# EAGLE design Zio Qwiic HAT (EAGLE 9.1.1)
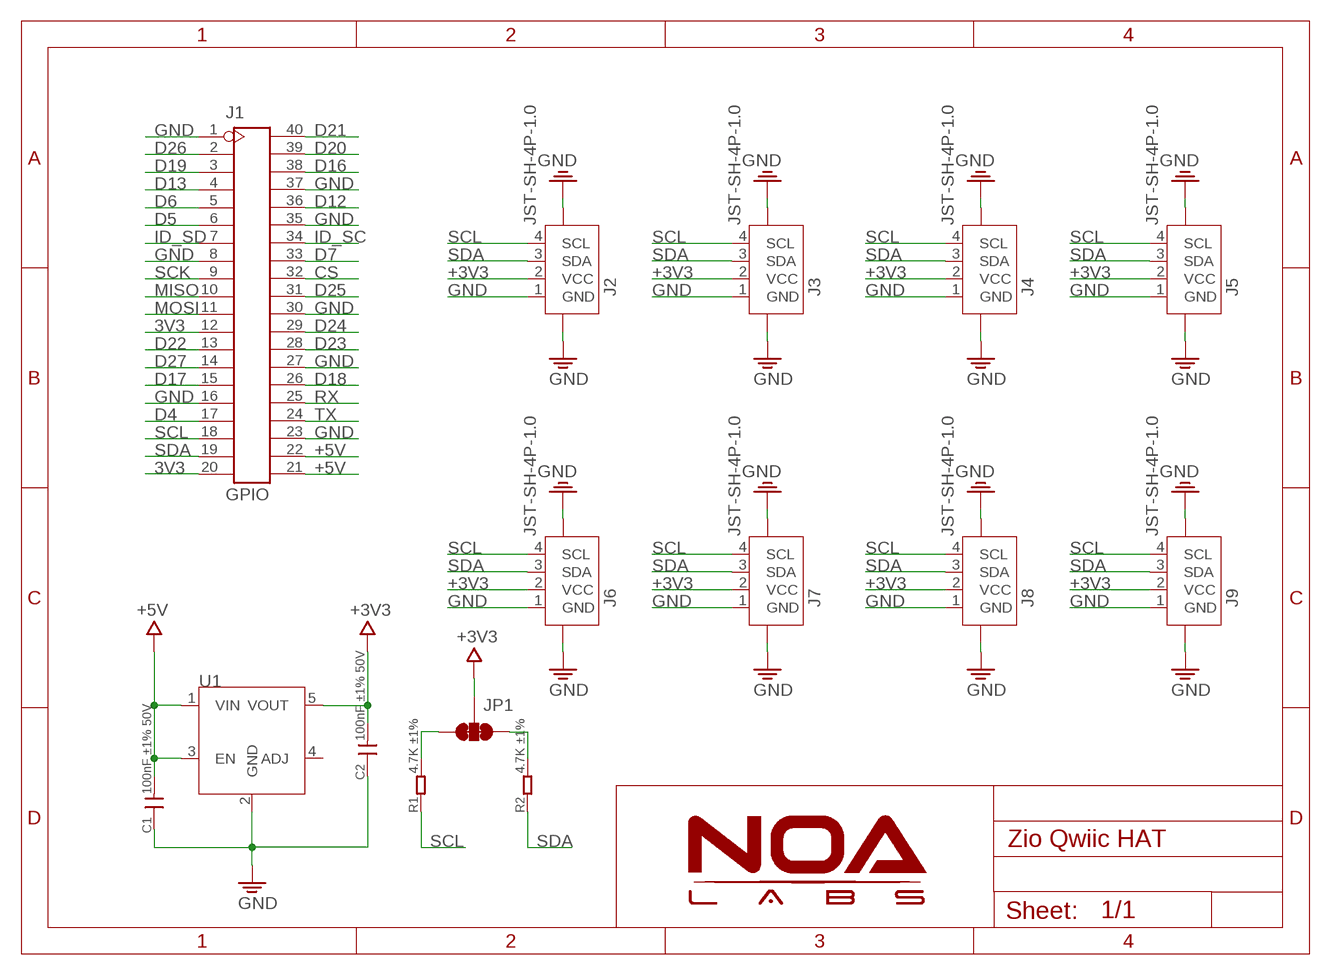
[diagram p0: schematic, sheet 1]

## Parts
C1  100nF ±1% 50V  C-0603  [C0603]
C2  100nF ±1% 50V  C-0603  [C0603]
J1  GPIO  HEADER_2X20P  [2X20P_2.54]
J2  JST-SH-4P-1.0  [JST-SH-4P]
J3  JST-SH-4P-1.0  [JST-SH-4P]
J4  JST-SH-4P-1.0  [JST-SH-4P]
J5  JST-SH-4P-1.0  [JST-SH-4P]
J6  JST-SH-4P-1.0  [JST-SH-4P]
J7  JST-SH-4P-1.0  [JST-SH-4P]
J8  JST-SH-4P-1.0  [JST-SH-4P]
J9  JST-SH-4P-1.0  [JST-SH-4P]
JP1  SMT-JUMPER_3_2-NC_TRACE  [SMT-JUMPER_3_2-NC_TRACE]
R1  4.7K ±1%  R-0603  [R0603]
R2  4.7K ±1%  R-0603  [R0603]
U1  AP2112  [SOT23-5]

## Nets
3V3: J1.12 J1.20
+3V3: C2.2 J2.2(VCC) J3.2(VCC) J4.2(VCC) J5.2(VCC) J6.2(VCC) J7.2(VCC) J8.2(VCC) J9.2(VCC) JP1.2 U1.5(VOUT)
+5V: C1.2 J1.21 J1.22 U1.1(VIN) U1.3(EN)
CS: J1.32
D4: J1.17
D5: J1.6
D6: J1.5
D7: J1.33
D12: J1.36
D13: J1.4
D16: J1.38
D17: J1.15
D18: J1.26
D19: J1.3
D20: J1.39
D21: J1.40
D22: J1.13
D23: J1.28
D24: J1.29
D25: J1.31
D26: J1.2
D27: J1.14
GND: C1.1 C2.1 J1.1 J1.8 J1.16 J1.23 J1.27 J1.30 J1.35 J1.37 J2.1(GND) J2.NC1 J2.NC2 J3.1(GND) J3.NC1 J3.NC2 J4.1(GND) J4.NC1 J4.NC2 J5.1(GND) J5.NC1 J5.NC2 J6.1(GND) J6.NC1 J6.NC2 J7.1(GND) J7.NC1 J7.NC2 J8.1(GND) J8.NC1 J8.NC2 J9.1(GND) J9.NC1 J9.NC2 U1.2(GND)
ID_SC: J1.34
ID_SD: J1.7
MISO: J1.10
MOSI: J1.11
N$34: JP1.3 R1.2
N$36: JP1.1 R2.2
RX: J1.25
SCK: J1.9
SCL: J1.18 J2.4(SCL) J3.4(SCL) J4.4(SCL) J5.4(SCL) J6.4(SCL) J7.4(SCL) J8.4(SCL) J9.4(SCL) R1.1
SDA: J1.19 J2.3(SDA) J3.3(SDA) J4.3(SDA) J5.3(SDA) J6.3(SDA) J7.3(SDA) J8.3(SDA) J9.3(SDA) R2.1
TX: J1.24
Unconnected: U1.4(ADJ)

## Library data of the parts
C1 C2 = RCL:C
J1 = Connector:HEADER_2X20P
J2-J9 = Connector:JST-SH-4P
JP1 = NOA-Jumpers:SMT-JUMPER_3_2-NC_TRACE
R1 R2 = RCL:R
U1 = IC_NOA:AP2112

## Board
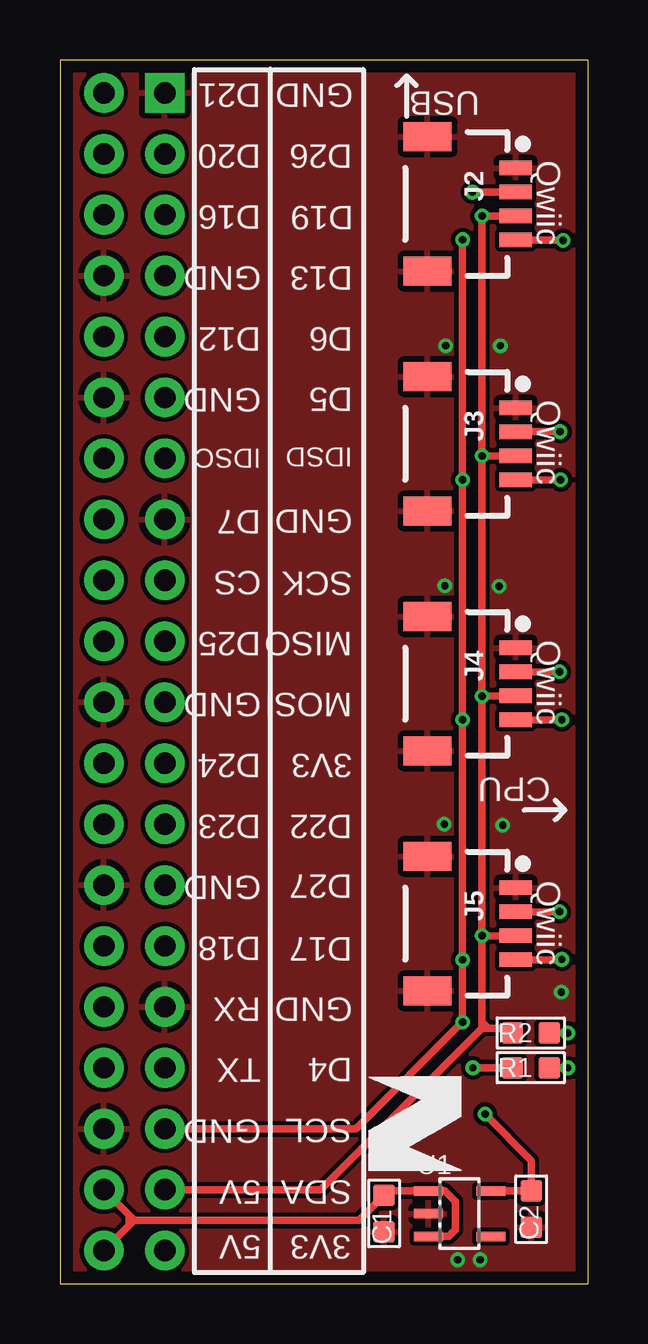
[diagram p1: board, top side]
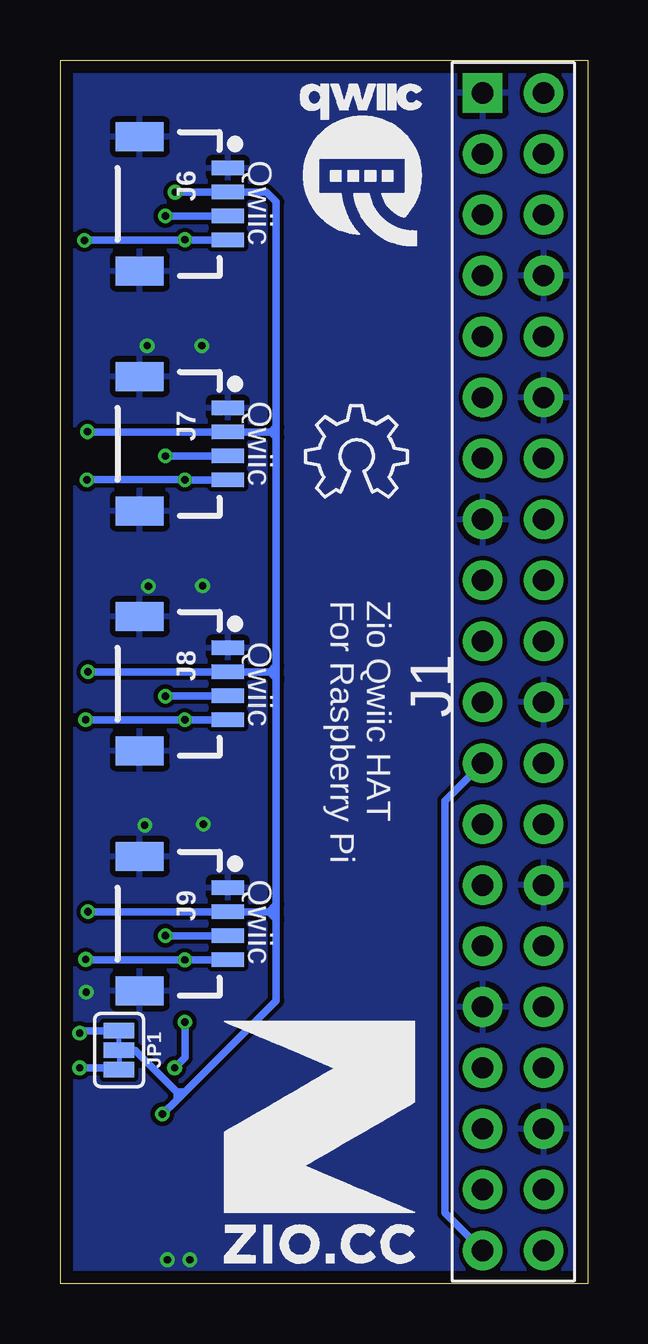
[diagram p2: board, bottom side, seen from below]

Size 22 x 51 mm. Coordinates in mm from the lower left corner, seen from the top.
Outline: 0,0 22,0 22,51 0,51 0,0
Copper layers (1*16): Top 0.035mm / dielectric 1.5mm / Bottom 0.035mm
Design rules "NOA Eagle Rule": minimum track width 7mil, minimum drill 12mil, track to track 7mil, track to pad 7mil, pad to pad 7mil, via to via 7mil, smd to smd 0mil, copper to edge 20mil, drill to drill 10mil, minimum pad ring 10mil, minimum via ring 6mil, stop-mask expansion 2mil, vias tented up to drill 25mil, thermal gap 10mil

### Footprints (pad centres in the part's own frame; a part is rotated, then mirrored left to right if it is on the bottom)
C0603 = smd 0.889 x 0.889: 1 -0.762,0; 2 0.762,0
2X20P_2.54 = drill 0.889 pad 1.651 square: 1 -1.27,24.13 | drill 0.889 pad 1.651: 2 -1.27,21.59; 3 -1.27,19.05; 4 -1.27,16.51; 5 -1.27,13.97; 6 -1.27,11.43; 7 -1.27,8.89; 8 -1.27,6.35; 9 -1.27,3.81; 10 -1.27,1.27; 11 -1.27,-1.27; 12 -1.27,-3.81; 13 -1.27,-6.35; 14 -1.27,-8.89; 15 -1.27,-11.43; 16 -1.27,-13.97; 17 -1.27,-16.51; 18 -1.27,-19.05; 19 -1.27,-21.59; 20 -1.27,-24.13; 21 1.27,-24.13; 22 1.27,-21.59; 23 1.27,-19.05; 24 1.27,-16.51; 25 1.27,-13.97; 26 1.27,-11.43; 27 1.27,-8.89; 28 1.27,-6.35; 29 1.27,-3.81; 30 1.27,-1.27; 31 1.27,1.27; 32 1.27,3.81; 33 1.27,6.35; 34 1.27,8.89; 35 1.27,11.43; 36 1.27,13.97; 37 1.27,16.51; 38 1.27,19.05; 39 1.27,21.59; 40 1.27,24.13
JST-SH-4P = smd 0.6 x 1.35: 1 1.5,0; 2 0.5,0; 3 -0.5,0; 4 -1.5,0 | smd 1.2 x 2: NC1 -2.8,3.675; NC2 2.8,3.675
SMT-JUMPER_3_2-NC_TRACE = smd 0.635 x 1.27: 1 -0.813,0; 2 0,0; 3 0.813,0
R0603 = smd 0.889 x 0.889: 1 -0.762,0; 2 0.762,0
SOT23-5 = smd 0.4 x 1.2: 1 -0.95,-1.3; 2 0,-1.3; 3 0.95,-1.3; 4 0.95,1.3; 5 -0.95,1.3

### Placement (x,y rotation side)
C1  13.51,2.92 90 top
C2  19.65,3.1 90 top
J1  3.1,25.5 0 bottom
J2  19,45 90 top
J3  19,35 90 top
J4  19,25 90 top
J5  19,15 90 top
J6  15,45 90 bottom
J7  15,35 90 bottom
J8  15,25 90 bottom
J9  15,15 90 bottom
JP1  19.53,9.73 270 bottom
R1  19.63,8.99 0 top
R2  19.63,10.44 0 top
U1  16.66,2.91 270 top
U$4  [10MM]  15.16,0.86 0 bottom
U$5  [QWIIC-LOGO-MEDIUM]  9.45,46.69 0 bottom
U$6  [OSHW_6X150_NOTEXT]  11.76,32.79 0 bottom
U$7  [6MM]  16.76,8.64 180 top

### Tracks (layer width: path | path; a pad name or v marks a point on that pad's centre or on a via)
3V3
  Bottom 0.305: J1.12 5.94,20.12 5.94,2.94 J1.20
+3V3  (via drill 0.3)
  Top 0.305: U1.5 C2.2 | C2.2 | C2.2 19.65,5.12 v17.73,7.06 | v17.2,45.49 J2.2 | v20.85,35.51 J3.2 | v20.83,25.5 J4.2 | v20.83,15.49 v20.82,15.5 J5.2
  Bottom 0.305: v17.73,7.06 17.11,7.66 | 17.11,7.66 16.78,7.99 | 16.78,7.99 12.98,11.79 12.98,15.16 | 12.98,15.16 12.98,15.8 | 12.98,15.8 12.98,25.12 | 12.98,25.12 12.98,25.76 | 12.98,25.76 12.98,35.28 | 12.98,35.28 12.98,35.71 | 12.98,35.71 12.98,45.09 13.39,45.5 J6.2 17.19,45.5 v17.2,45.49 | 13.19,35.5 J7.2 v20.84,35.5 v20.85,35.51 | 13.19,35.5 12.98,35.71 | 13.19,35.5 12.98,35.29 12.98,35.28 | 13.23,25.5 J8.2 v20.83,25.5 | 13.23,25.5 12.98,25.76 | 13.23,25.5 12.98,25.24 12.98,25.12 | 13.28,15.5 J9.2 v20.82,15.5 v20.83,15.49 | 13.28,15.5 12.98,15.8 | 13.28,15.5 12.98,15.2 12.98,15.16 | JP1.2 18.87,9.73 17.13,7.99 | 17.13,7.99 16.78,7.99 | 17.13,7.99 17.11,7.96 17.11,7.66
+5V
  Top 0.305: J1.21 2.88,2.42 | 2.88,2.42 3.1,2.64 | 3.1,2.64 12.47,2.64 C1.2 13.69,3.86 U1.1 16.05,3.86 16.48,3.43 16.48,2.23 16.21,1.96 U1.3 | J1.22 2.9,2.85 | 2.9,2.85 3.1,2.64 | 2.9,2.85 2.9,2.44 2.88,2.42
GND  (via drill 0.3)
  other vias: 16.59,0.99 17.53,0.99 16.03,19.15 18.47,19.1 16.05,29.08 18.31,29.06 18.36,39.09 16.08,39.09 20.9,12.14
  pour Bottom: 0,51 22,51 22,0 0,0
  pour Top: 0,51 22.02,51 22.02,0 0,0
N$34  (via drill 0.3)
  Top 0.305: R1.2 v21.17,8.99
  Bottom 0.305: JP1.3 19.61,8.99 v21.17,8.99
N$36  (via drill 0.3)
  Top 0.305: R2.2 v21.17,10.44
  Bottom 0.305: JP1.1 21.07,10.54 v21.17,10.44
SCL  (via drill 0.3)
  Top 0.305: J1.18 12.34,6.45 v16.79,10.9 v16.79,13.49 v16.79,23.5 v16.79,33.5 v16.79,43.51 | J2.4 20.96,43.5 v20.98,43.48 | J5.4 20.92,13.5 v20.93,13.51 | J4.4 v20.93,23.5 | J3.4 v20.88,33.5 | R1.1 v17.22,8.99
  Bottom 0.305: v16.79,43.51 v16.78,43.5 | v16.78,43.5 J6.4 | v20.98,43.48 20.96,43.5 v16.78,43.5 | J7.4 v16.79,33.5 | v16.79,33.5 | J8.4 v16.78,23.5 | v16.78,23.5 v16.79,23.5 | J9.4 16.78,13.5 | 16.78,13.5 v16.79,13.49 | v20.93,13.51 20.92,13.5 16.78,13.5 | v20.93,23.5 v16.79,23.5 | v16.79,23.5 v16.78,23.5 | v20.88,33.5 v16.79,33.5 | v16.79,33.5 | v17.22,8.99 16.79,9.42 v16.79,10.9
SDA  (via drill 0.3)
  Top 0.305: J1.19 10.87,3.91 17.6,10.64 | 17.6,10.64 17.6,10.92 | 17.6,10.92 v17.6,14.5 | v17.6,14.5 v17.6,24.49 | v17.6,24.49 v17.6,34.49 | v17.6,34.49 v17.6,44.5 J2.3 | J5.3 v17.61,14.5 v17.6,14.5 | J4.3 17.62,24.5 v17.6,24.49 | J3.3 v17.6,34.49 | R2.1 18.67,10.64 17.86,10.64 | 17.86,10.64 17.6,10.64 | 17.86,10.64 17.6,10.9 17.6,10.92
  Bottom 0.305: v17.6,44.5 J6.3 | J7.3 v17.59,34.5 v17.6,34.49 | J8.3 17.59,24.5 v17.6,24.49 | J9.3 v17.6,14.5

### Text on the board
tPlace: D21 | GND | USB | D20 | D26 | Qwiic | D16 | D19 | GND | D13 | D12 | D6 | GND | D5 | Qwiic | IDSC | IDSD | D7 | GND | CS | SCK | D25 | MISO | Qwiic | GND | MOSI | D24 | 3V3 | CPU | D23 | D22 | GND | D27 | Qwiic | D18 | D17 | RX | GND | TX | D4 | GND | SCL | 5V | SDA | 5V | 3V3
bPlace: Qwiic | Qwiic | Zio Qwiic HAT / For Raspberry Pi | Qwiic | Qwiic